# EAGLE design MIDI Input (EAGLE 8.4.0)
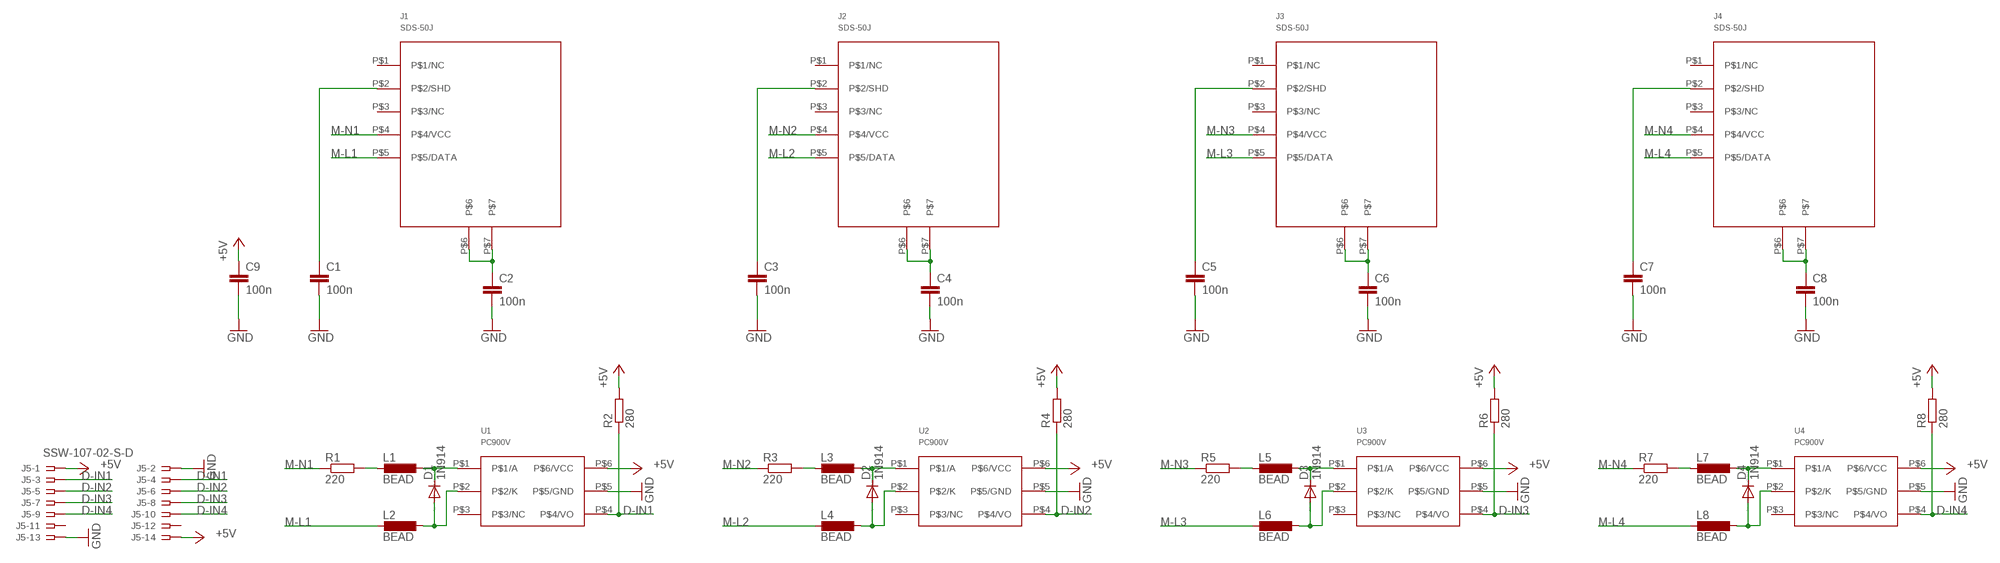
[diagram p0: schematic, sheet 1]

## Parts
C1  100n  C-EUC0805  [C0805]
C2  100n  C-EUC0805  [C0805]
C3  100n  C-EUC0805  [C0805]
C4  100n  C-EUC0805  [C0805]
C5  100n  C-EUC0805  [C0805]
C6  100n  C-EUC0805  [C0805]
C7  100n  C-EUC0805  [C0805]
C8  100n  C-EUC0805  [C0805]
C9  100n  C-EUC0805  [C0805]
D1  1N914  [SOD323-W]
D2  1N914  [SOD323-W]
D3  1N914  [SOD323-W]
D4  1N914  [SOD323-W]
J1  SDS-50J  [SDS-50J]
J2  SDS-50J  [SDS-50J]
J3  SDS-50J  [SDS-50J]
J4  SDS-50J  [SDS-50J]
J5  SSW-107-02-S-D  [SSW-107-02-S-D]
L1  BEAD  [L0805]
L2  BEAD  [L0805]
L3  BEAD  [L0805]
L4  BEAD  [L0805]
L5  BEAD  [L0805]
L6  BEAD  [L0805]
L7  BEAD  [L0805]
L8  BEAD  [L0805]
R1  220  R-EU_R0805  [R0805]
R2  280  R-EU_R0805  [R0805]
R3  220  R-EU_R0805  [R0805]
R4  280  R-EU_R0805  [R0805]
R5  220  R-EU_R0805  [R0805]
R6  280  R-EU_R0805  [R0805]
R7  220  R-EU_R0805  [R0805]
R8  280  R-EU_R0805  [R0805]
U1  PC900V  [DIL06]
U2  PC900V  [DIL06]
U3  PC900V  [DIL06]
U4  PC900V  [DIL06]

## Nets
+5V: C9.1 J5.1 J5.14 R2.2 R4.2 R6.2 R8.2 U1.P$6(P$6/VCC) U2.P$6(P$6/VCC) U3.P$6(P$6/VCC) U4.P$6(P$6/VCC)
D-IN1: J5.3 J5.4 R2.1 U1.P$4(P$4/VO)
D-IN2: J5.5 J5.6 R4.1 U2.P$4(P$4/VO)
D-IN3: J5.7 J5.8 R6.1 U3.P$4(P$4/VO)
D-IN4: J5.9 J5.10 R8.1 U4.P$4(P$4/VO)
GND: C1.2 C2.2 C3.2 C4.2 C5.2 C6.2 C7.2 C8.2 C9.2 J5.2 J5.13 U1.P$5(P$5/GND) U2.P$5(P$5/GND) U3.P$5(P$5/GND) U4.P$5(P$5/GND)
M-L1: J1.P$5(P$5/DATA) L2.1
M-L2: J2.P$5(P$5/DATA) L4.1
M-L3: J3.P$5(P$5/DATA) L6.1
M-L4: J4.P$5(P$5/DATA) L8.1
M-N1: J1.P$4(P$4/VCC) R1.1
M-N2: J2.P$4(P$4/VCC) R3.1
M-N3: J3.P$4(P$4/VCC) R5.1
M-N4: J4.P$4(P$4/VCC) R7.1
N$1: L1.1 R1.2
N$2: D1.C L1.2 U1.P$1(P$1/A)
N$3: D1.A L2.2 U1.P$2(P$2/K)
N$5: D2.C L3.2 U2.P$1(P$1/A)
N$6: C2.1 J1.P$6 J1.P$7
N$7: D2.A L4.2 U2.P$2(P$2/K)
N$10: C4.1 J2.P$6 J2.P$7
N$11: C1.1 J1.P$2(P$2/SHD)
N$13: C3.1 J2.P$2(P$2/SHD)
N$15: L3.1 R3.2
N$17: D3.C L5.2 U3.P$1(P$1/A)
N$18: D3.A L6.2 U3.P$2(P$2/K)
N$19: C6.1 J3.P$6 J3.P$7
N$21: C5.1 J3.P$2(P$2/SHD)
N$23: L5.1 R5.2
N$25: D4.C L7.2 U4.P$1(P$1/A)
N$26: D4.A L8.2 U4.P$2(P$2/K)
N$27: C8.1 J4.P$6 J4.P$7
N$29: C7.1 J4.P$2(P$2/SHD)
N$31: L7.1 R7.2
Unconnected: J1.P$1(P$1/NC) J1.P$3(P$3/NC) J2.P$1(P$1/NC) J2.P$3(P$3/NC) J3.P$1(P$1/NC) J3.P$3(P$3/NC) J4.P$1(P$1/NC) J4.P$3(P$3/NC) J5.11 J5.12 U1.P$3(P$3/NC) U2.P$3(P$3/NC) U3.P$3(P$3/NC) U4.P$3(P$3/NC)

## Library data of the parts
C1-C9 = rcl:C-EU: CAPACITOR, European symbol
D1-D4 = MIDI router parts:1N914
J1-J4 = MIDI router parts:SDS-50J
J5 = con-samtec:SSW-107-02-S-D: THROUGH-HOLE .025" SQ POST SOCKET Source: Samtec SSW.pdf; MPN: SSW-107-02-S-D; OC_FARNELL: unknown; OC_NEWARK: 11P9431
L1-L8 = MIDI router parts:BEAD
R1-R8 = rcl:R-EU_: RESISTOR, European symbol
U1-U4 = MIDI router parts:PC900V

## Board
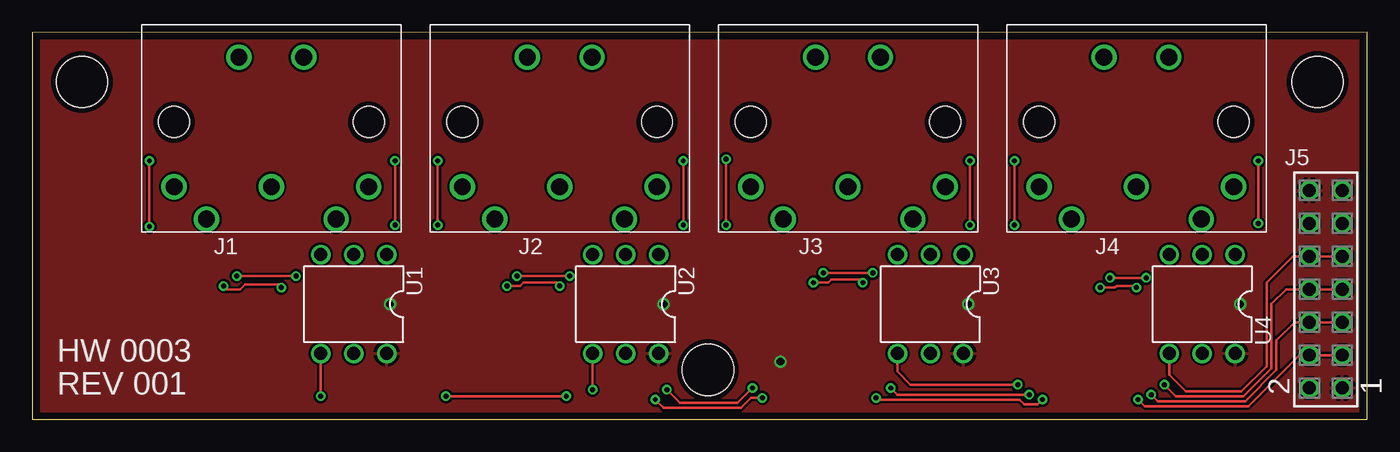
[diagram p1: board, top side]
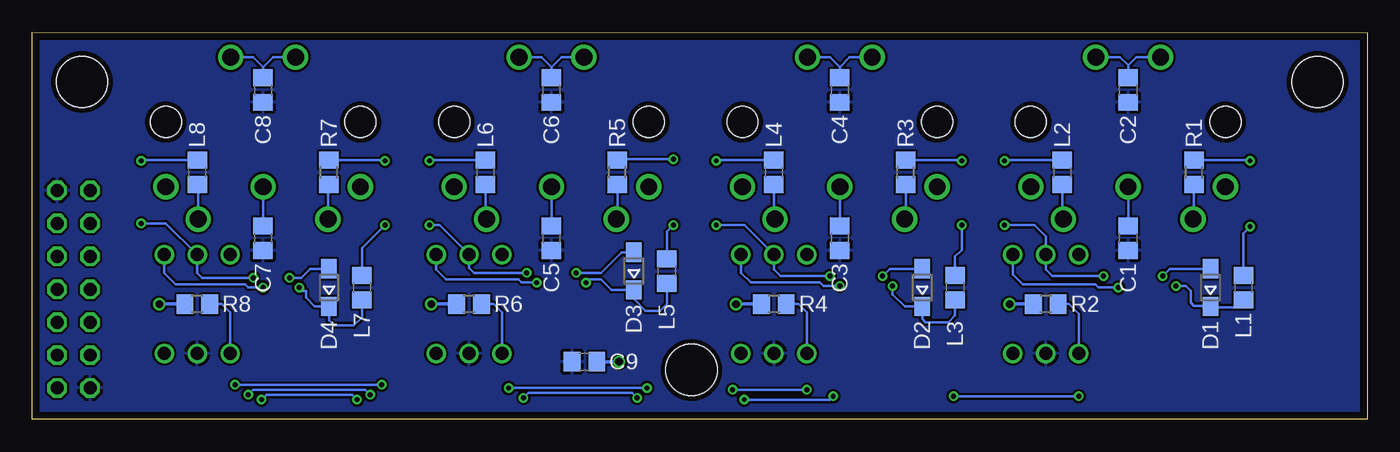
[diagram p2: board, bottom side, seen from below]

Size 102.87 x 29.84 mm. Coordinates in mm from the lower left corner, seen from the top.
Outline: 0,0 102.87,0 102.87,29.84 0,29.84 0,0
Copper layers (1*16): Top 0.0356mm / dielectric 1.5011mm / Bottom 0.0356mm
Design rules "LaenPCBOrder *": minimum track width 6mil, minimum drill 13mil, track to track 7mil, track to pad 7mil, pad to pad 7mil, via to via 7mil, smd to smd 7mil, copper to edge 15mil, drill to drill 6mil, minimum pad ring 7mil, minimum via ring 7mil, stop-mask expansion 3mil, vias tented up to drill 0mil, thermal gap 10mil
Holes 3.96 mm at 3.81,26.04 52.07,3.81 99.06,26.04

### Footprints (pad centres in the part's own frame; a part is rotated, then mirrored left to right if it is on the bottom)
C0805 = smd 1.3 x 1.5: 1 -0.95,0; 2 0.95,0
SOD323-W = smd 1.5 x 1.2: A 1.45,0; C -1.45,0
SDS-50J = drill 1.3: P$1 7.5,10; P$2 0,10; P$3 -7.5,10; P$4 5,12.5; P$5 -5,12.5; P$6 2.5,0; P$7 -2.5,0 | hole 2.4: -7.5,5; 7.5,5
SSW-107-02-S-D = drill 1 pad 1.5 octagon: 1 -7.62,-1.27; 2 -7.62,1.27; 3 -5.08,-1.27; 4 -5.08,1.27; 5 -2.54,-1.27; 6 -2.54,1.27; 7 0,-1.27; 8 0,1.27; 9 2.54,-1.27; 10 2.54,1.27; 11 5.08,-1.27; 12 5.08,1.27; 13 7.62,-1.27; 14 7.62,1.27
L0805 = smd 1.3 x 1.5: 1 -0.95,0; 2 0.95,0
R0805 = smd 1.3 x 1.5: 1 -0.95,0; 2 0.95,0
DIL06 = drill 1: P$1 -2.54,-3.81; P$2 0,-3.81; P$3 2.54,-3.81; P$4 2.54,3.81; P$5 0,3.81; P$6 -2.54,3.81

### Placement (x,y rotation side)
C1  18.41,13.97 270 bottom
C2  18.41,25.4 270 bottom
C3  40.64,13.97 270 bottom
C4  40.64,25.4 270 bottom
C5  62.87,13.97 270 bottom
C6  62.87,25.4 270 bottom
C7  85.09,13.97 270 bottom
C8  85.09,25.4 270 bottom
C9  60.33,4.45 180 bottom
D1  12.06,10.16 90 bottom
D2  34.29,10.16 90 bottom
D3  56.52,11.43 90 bottom
D4  80.01,10.16 90 bottom
J1  18.41,27.94 180 top
J2  40.64,27.94 180 top
J3  62.87,27.94 180 top
J4  85.09,27.94 180 top
J5  99.69,10.03 90 top
L1  9.53,10.16 270 bottom
L2  23.5,19.05 90 bottom
L3  31.75,10.16 270 bottom
L4  45.72,19.05 90 bottom
L5  53.98,11.43 270 bottom
L6  67.94,19.05 90 bottom
L7  77.47,10.16 270 bottom
L8  90.17,19.05 90 bottom
R1  13.34,19.05 90 bottom
R2  24.77,8.89 180 bottom
R3  35.56,19.05 90 bottom
R4  45.72,8.89 180 bottom
R5  57.78,19.05 90 bottom
R6  69.22,8.89 180 bottom
R7  80.01,19.05 90 bottom
R8  90.17,8.89 180 bottom
U1  24.77,8.89 180 top
U2  45.72,8.89 180 top
U3  69.22,8.89 180 top
U4  90.17,8.89 180 top

### Tracks (layer width: path | path; a pad name or v marks a point on that pad's centre or on a via)
+5V  (via drill 0.58)
  Bottom 0.254: C9.1 v57.66,4.45 | R4.2 v48.64,8.89 | R2.2 v27.56,8.89 | R6.2 v72.14,8.89 | R8.2 v93.09,8.89
  pour Top: 0.64,29.21 0.64,0.64 102.23,0.64 102.23,29.21
D-IN1  (via drill 0.38)
  Top 0.191: J5.3 J5.4 97.66,4.95 93.73,1.02 85.72,1.02 v85.22,1.52 | v77.85,1.52 77.47,1.14 76.45,1.14 76.07,1.52 65.15,1.52 v65.02,1.65 | v56.26,1.65 55.37,1.65 54.61,0.89 48.64,0.89 v48.01,1.52 | v41.15,1.78 v31.88,1.78 | v22.23,1.78 U1.P$4
  Bottom 0.191: U1.P$4 22.23,8.13 22.99,8.89 R2.1 | v85.22,1.52 84.84,1.91 78.23,1.91 v77.85,1.52 | v65.02,1.65 64.64,2.03 56.64,2.03 v56.26,1.65 | v48.01,1.52 41.4,1.52 v41.15,1.78 | v31.88,1.78 v22.23,1.78
D-IN2  (via drill 0.38)
  Top 0.191: J5.5 J5.6 97.28,7.49 95.89,6.1 95.89,3.81 93.47,1.4 86.74,1.4 v86.23,1.91 | v66.17,2.41 66.67,1.91 v76.83,1.91 | v55.5,2.41 54.36,1.27 49.91,1.27 v48.9,2.29 | v43.18,2.29 U2.P$4
  Bottom 0.191: U2.P$4 43.18,8.26 43.81,8.89 R4.1 | v86.23,1.91 85.85,2.29 77.22,2.29 v76.83,1.91 | v66.17,2.41 v55.5,2.41 | v48.9,2.29 v43.18,2.29
D-IN3  (via drill 0.38)
  Top 0.191: J5.7 J5.8 96.65,10.03 95.5,8.89 95.5,3.95 93.33,1.78 88.14,1.78 v87.25,2.67 | v75.95,2.67 67.69,2.67 66.67,3.68 U3.P$4
  Bottom 0.191: U3.P$4 66.67,8.26 67.31,8.89 R6.1 | v87.25,2.67 v75.95,2.67
D-IN4
  Top 0.191: J5.9 J5.10 97.16,12.57 95.12,10.54 95.12,4.09 93.19,2.16 88.9,2.16 87.63,3.43 U4.P$4
  Bottom 0.191: U4.P$4 87.63,8.26 88.27,8.89 R8.1
GND
  pour Bottom: 0.64,29.21 0.64,0.64 102.23,0.64 102.23,29.21
M-L1
  Bottom 0.191: J1.P$5 23.5,15.52 L2.1
M-L2
  Bottom 0.191: J2.P$5 45.72,15.52 L4.1
M-L3
  Bottom 0.191: J3.P$5 67.94,15.52 L6.1
M-L4
  Bottom 0.191: J4.P$5 90.09,18.02 L8.1
M-N1
  Bottom 0.191: J1.P$4 13.34,15.52 R1.1
M-N2
  Bottom 0.191: J2.P$4 35.56,15.52 R3.1
M-N3
  Bottom 0.191: J3.P$4 57.78,15.52 R5.1
M-N4
  Bottom 0.191: J4.P$4 80.09,18.02 R7.1
N$1  (via drill 0.38)
  Top 0.191: v9.02,19.94 v9.02,14.86
  Bottom 0.191: R1.2 9.08,20 v9.02,19.94 | v9.02,14.86 9.53,14.35 L1.1
N$2  (via drill 0.38)
  Top 0.191: v14.73,10.29 14.99,10.03 16,10.03 16.38,10.41 18.92,10.41 v19.18,10.16
  Bottom 0.191: L1.2 10.1,8.64 11.99,8.64 D1.C 12.12,8.76 13.34,8.76 13.59,9.02 13.59,9.91 13.97,10.29 v14.73,10.29 | v19.18,10.16 20.7,10.16 20.95,10.41 26.54,10.41 27.3,11.18 U1.P$1
N$3  (via drill 0.38)
  Top 0.191: v27.94,19.94 v27.94,14.99 | v15.75,11.05 v20.32,11.05
  Bottom 0.191: L2.2 27.88,20 v27.94,19.94 | v27.94,14.99 25.65,14.99 24.77,14.1 U1.P$2 24.77,11.56 24.26,11.05 v20.32,11.05 | D1.A 15.19,11.61 v15.75,11.05
N$5  (via drill 0.38)
  Top 0.191: v36.58,10.29 37.59,10.29 37.85,10.54 40.39,10.54 v40.64,10.29
  Bottom 0.191: L3.2 31.75,8 32.26,7.49 34.04,7.49 34.29,7.75 D2.C 35.63,8.71 36.58,9.65 v36.58,10.29 | v40.64,10.29 41.91,10.29 42.16,10.54 47.5,10.54 48.26,11.3 U2.P$1
N$6
  Bottom 0.191: J1.P$6 17.78,27.94 18.41,27.3 | 18.41,27.3 C2.1 | J1.P$7 19.05,27.94 18.41,27.3
N$7  (via drill 0.38)
  Top 0.191: v37.34,11.05 v41.4,11.05 | v50.16,19.94 v50.16,14.99
  Bottom 0.191: D2.A 36.78,11.61 v37.34,11.05 | v41.4,11.05 45.21,11.05 45.72,11.56 U2.P$2 48.01,14.99 v50.16,14.99 | L4.2 50.1,20 v50.16,19.94
N$10
  Bottom 0.191: 40.64,27.18 39.88,27.94 J2.P$6 | 40.64,27.18 C4.1 | 40.64,27.18 41.4,27.94 J2.P$7
N$11
  Bottom 0.191: J1.P$2 C1.1
N$13
  Bottom 0.191: J2.P$2 C3.1
N$15  (via drill 0.38)
  Top 0.191: v31.24,19.94 v31.24,14.99
  Bottom 0.191: R3.2 31.3,20 v31.24,19.94 | v31.24,14.99 31.24,13.08 31.75,12.57 L3.1
N$17  (via drill 0.38)
  Top 0.191: v60.2,10.54 61.34,10.54 61.59,10.79 63.75,10.79 v64.01,10.54
  Bottom 0.191: L5.2 53.98,8.89 54.48,8.38 55.63,8.38 56.52,9.27 D3.C 58.24,9.98 59.05,10.79 59.94,10.79 v60.2,10.54 | v64.01,10.54 65.15,10.54 65.41,10.79 70.99,10.79 71.75,11.56 U3.P$1
N$18  (via drill 0.38)
  Top 0.191: v72.26,19.94 v72.26,14.99 | v60.96,11.3 v64.77,11.3
  Bottom 0.191: L6.2 72.2,20 v72.26,19.94 | v72.26,14.99 71.5,14.99 U3.P$2 69.22,11.68 68.83,11.3 v64.77,11.3 | D3.A 57.48,12.88 59.05,11.3 v60.96,11.3
N$19
  Bottom 0.191: J3.P$6 62.1,27.94 62.87,27.18 | 62.87,27.18 C6.1 | J3.P$7 63.63,27.94 62.87,27.18
N$21
  Bottom 0.191: J3.P$2 C5.1
N$23  (via drill 0.38)
  Top 0.191: v53.47,20.07 v53.47,14.99
  Bottom 0.191: R5.2 57.72,20.07 v53.47,20.07 | v53.47,14.99 53.98,14.48 L5.1
N$25  (via drill 0.38)
  Top 0.191: v82.3,10.16 83.44,10.16 83.57,10.29 84.96,10.29 v85.09,10.16
  Bottom 0.191: L7.2 77.47,7.87 78.11,7.24 79.63,7.24 80.01,7.62 D4.C 81.1,8.71 81.79,9.4 81.79,9.91 82.04,9.91 v82.3,10.16 | v85.09,10.16 86.23,10.16 86.49,10.41 91.82,10.41 92.71,11.3 U4.P$1
N$26  (via drill 0.38)
  Top 0.191: v94.49,19.94 v94.49,15.11 | v83.06,10.92 v85.85,10.92
  Bottom 0.191: L8.2 94.43,20 v94.49,19.94 | v94.49,15.11 92.58,15.11 U4.P$2 90.17,11.3 89.79,10.92 v85.85,10.92 | D4.A 81.48,11.61 82.17,10.92 v83.06,10.92
N$27
  Bottom 0.191: J4.P$6 84.33,27.94 85.09,27.18 | 85.09,27.18 C8.1 | J4.P$7 85.85,27.94 85.09,27.18
N$29
  Bottom 0.191: C7.1 J4.P$2
N$31  (via drill 0.38)
  Top 0.191: v75.69,19.94 v75.69,14.99
  Bottom 0.191: R7.2 75.75,20 v75.69,19.94 | v75.69,14.99 77.47,13.21 L7.1

### Text on the board
tNames: HW 0003 | REV 001